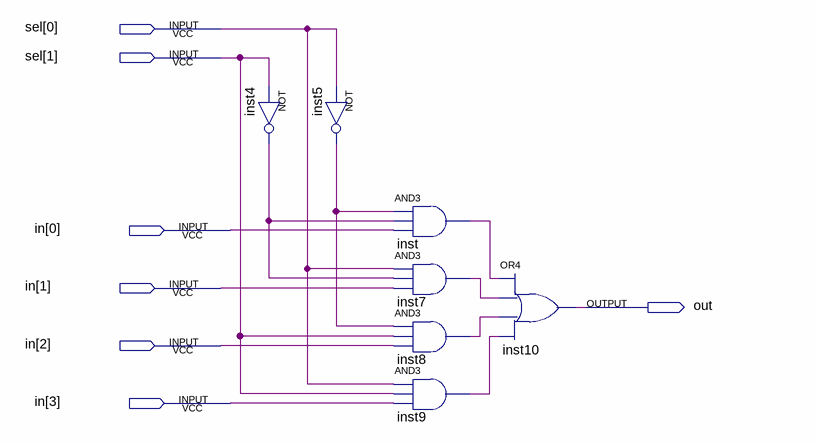
[diagram p0: schematic sheet]
// Quartus schematic mux4to1.bdf as structural Verilog: 7 symbols, 7 pins
module mux4to1 (
  input  [1:0] sel,
  input  [3:0] in,
  output out
);

  wire inst4_out, inst5_out, inst7_out, inst8_out, inst9_out, inst_out;

  not inst5 (inst5_out, sel[0]);
  not inst4 (inst4_out, sel[1]);
  and inst (inst_out, inst5_out, inst4_out, in[0]);
  and inst7 (inst7_out, sel[0], inst4_out, in[1]);
  and inst8 (inst8_out, inst5_out, sel[1], in[2]);
  and inst9 (inst9_out, sel[0], sel[1], in[3]);
  or inst10 (out, inst_out, inst7_out, inst8_out, inst9_out);
endmodule
